# Altium schematic sheet DPT2.0.SchDoc
size A2; SheetNumber: 1; SheetTotal: 3
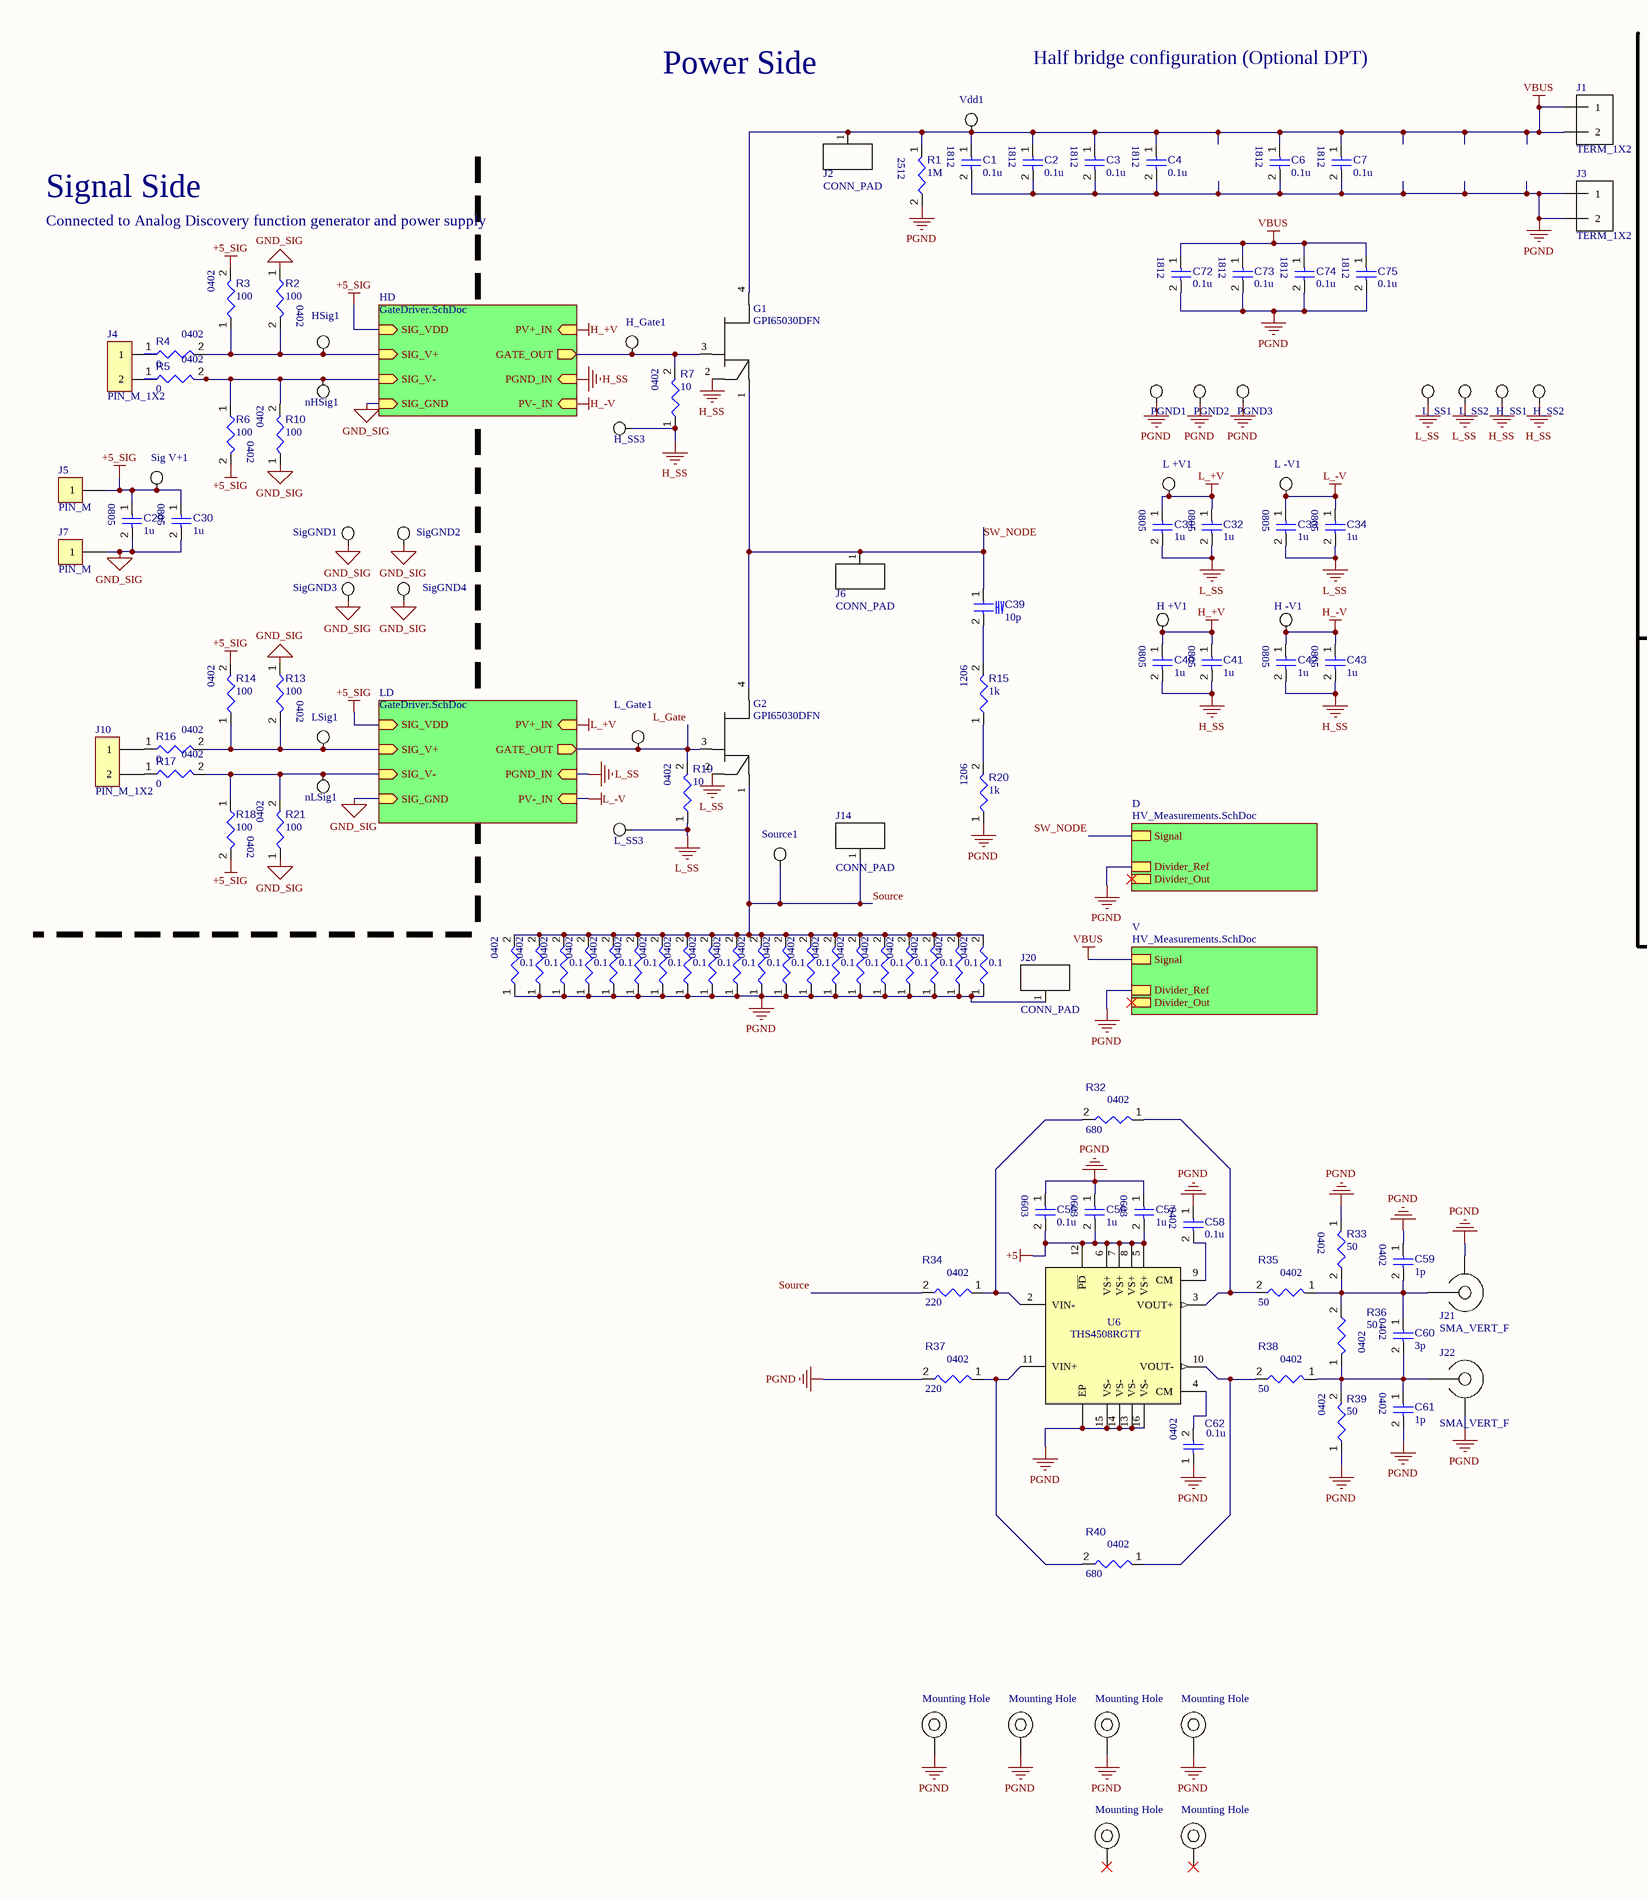
[diagram p0: DPT2.0.SchDoc, left]
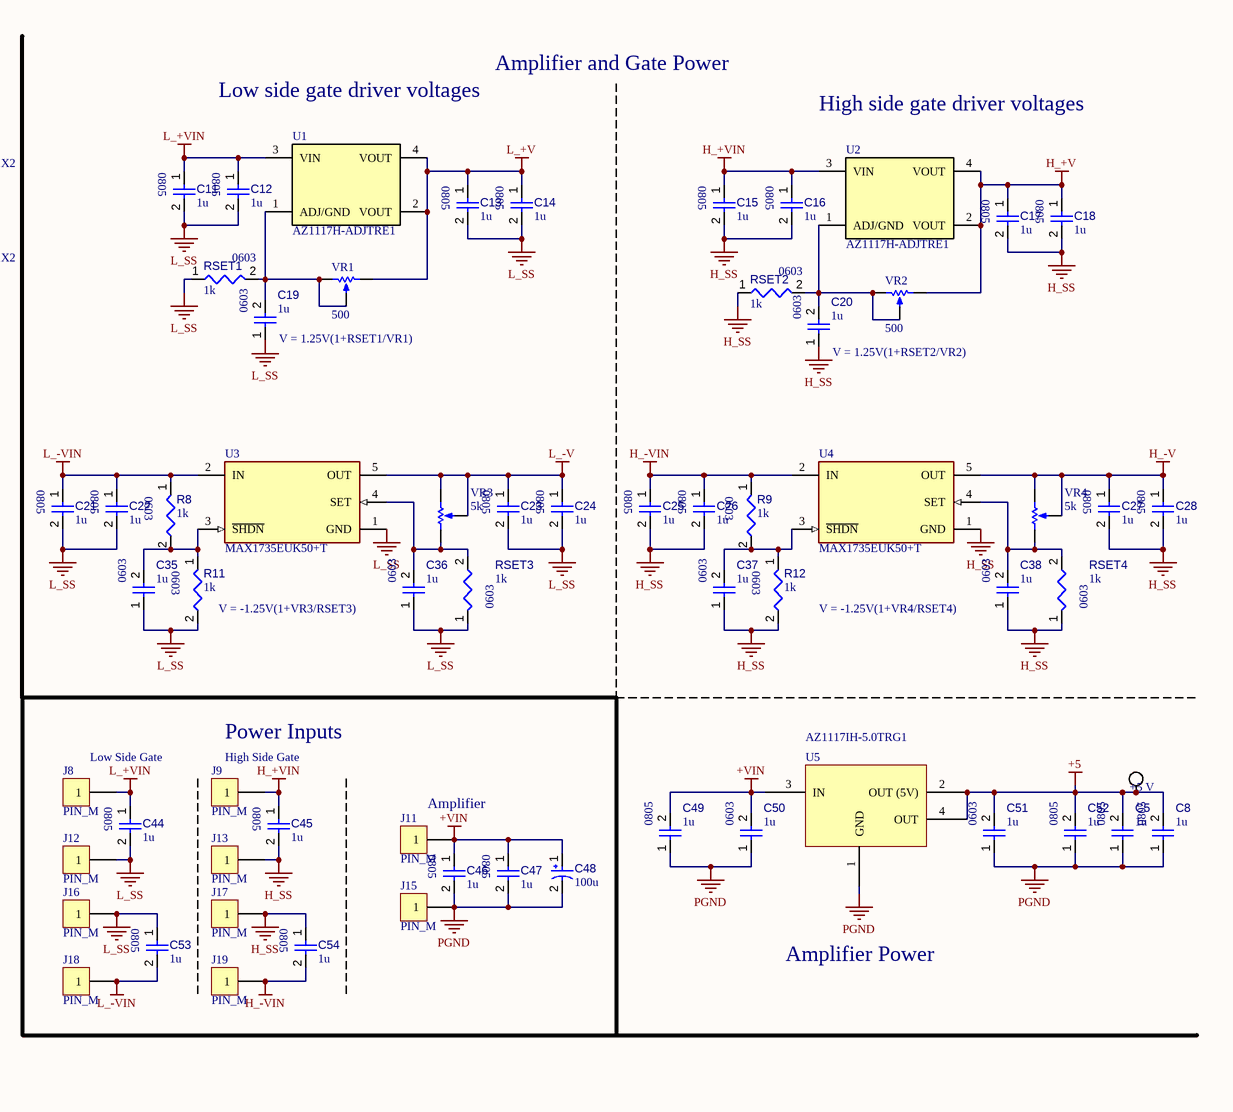
[diagram p1: DPT2.0.SchDoc, right]

## Parts
+5_V  Testpoint  [Testpoint-Footprint-1]  (value not drawn)
C1  value 0.1u  [CAP_1812]  (hidden comment: CAP-1812)
C2  value 0.1u  [CAP_1812]  (hidden comment: CAP-1812)
C3  value 0.1u  [CAP_1812]  (hidden comment: CAP-1812)
C4  value 0.1u  [CAP_1812]  (hidden comment: CAP-1812)
C5  value 1u  [CAP_0805_MED]  (hidden comment: CAP-0805)
C6  value 0.1u  [CAP_1812]  (hidden comment: CAP-1812)
C7  value 0.1u  [CAP_1812]  (hidden comment: CAP-1812)
C8  value 1u  [CAP_0805_MED]  (hidden comment: CAP-0805)
C11  value 1u  [CAP_0805_MED]  (hidden comment: CAP-0805)
C12  value 1u  [CAP_0805_MED]  (hidden comment: CAP-0805)
C13  value 1u  [CAP_0805_MED]  (hidden comment: CAP-0805)
C14  value 1u  [CAP_0805_MED]  (hidden comment: CAP-0805)
C15  value 1u  [CAP_0805_MED]  (hidden comment: CAP-0805)
C16  value 1u  [CAP_0805_MED]  (hidden comment: CAP-0805)
C17  value 1u  [CAP_0805_MED]  (hidden comment: CAP-0805)
C18  value 1u  [CAP_0805_MED]  (hidden comment: CAP-0805)
C19  value 1u  [CAP_0603_HIGH]  (hidden comment: CAP-0603)
C20  value 1u  [CAP_0603_HIGH]  (hidden comment: CAP-0603)
C21  value 1u  [CAP_0805_MED]  (hidden comment: CAP-0805)
C22  value 1u  [CAP_0805_MED]  (hidden comment: CAP-0805)
C23  value 1u  [CAP_0805_MED]  (hidden comment: CAP-0805)
C24  value 1u  [CAP_0805_MED]  (hidden comment: CAP-0805)
C25  value 1u  [CAP_0805_MED]  (hidden comment: CAP-0805)
C26  value 1u  [CAP_0805_MED]  (hidden comment: CAP-0805)
C27  value 1u  [CAP_0805_MED]  (hidden comment: CAP-0805)
C28  value 1u  [CAP_0805_MED]  (hidden comment: CAP-0805)
C29  value 1u  [CAP_0805_MED]  (hidden comment: CAP-0805)
C30  value 1u  [CAP_0805_MED]  (hidden comment: CAP-0805)
C31  value 1u  [CAP_0805_MED]  (hidden comment: CAP-0805)
C32  value 1u  [CAP_0805_MED]  (hidden comment: CAP-0805)
C33  value 1u  [CAP_0805_MED]  (hidden comment: CAP-0805)
C34  value 1u  [CAP_0805_MED]  (hidden comment: CAP-0805)
C35  value 1u  [CAP_0603_HIGH]  (hidden comment: CAP-0603)
C36  value 1u  [CAP_0603_HIGH]  (hidden comment: CAP-0603)
C37  value 1u  [CAP_0603_HIGH]  (hidden comment: CAP-0603)
C38  value 1u  [CAP_0603_HIGH]  (hidden comment: CAP-0603)
C39  value 10p  [CAP_1206_HV]  (hidden comment: CAP-1206-HV)
C40  value 1u  [CAP_0805_MED]  (hidden comment: CAP-0805)
C41  value 1u  [CAP_0805_MED]  (hidden comment: CAP-0805)
C42  value 1u  [CAP_0805_MED]  (hidden comment: CAP-0805)
C43  value 1u  [CAP_0805_MED]  (hidden comment: CAP-0805)
C44  value 1u  [CAP_0805_MED]  (hidden comment: CAP-0805)
C45  value 1u  [CAP_0805_MED]  (hidden comment: CAP-0805)
C46  value 1u  [CAP_0805_MED]  (hidden comment: CAP-0805)
C47  value 1u  [CAP_0805_MED]  (hidden comment: CAP-0805)
C48  value 100u  [PCAP_2MM_5MM]  (hidden comment: PCAP-2MMx5MM)
C49  value 1u  [CAP_0805_MED]  (hidden comment: CAP-0805)
C50  value 1u  [CAP_0603_HIGH]  (hidden comment: CAP-0603)
C51  value 1u  [CAP_0603_HIGH]  (hidden comment: CAP-0603)
C52  value 1u  [CAP_0805_MED]  (hidden comment: CAP-0805)
C53  value 1u  [CAP_0805_MED]  (hidden comment: CAP-0805)
C54  value 1u  [CAP_0805_MED]  (hidden comment: CAP-0805)
C55  value 0.1u  [CAP_0603_HIGH]  (hidden comment: CAP-0603)
C56  value 1u  [CAP_0603_HIGH]  (hidden comment: CAP-0603)
C57  value 1u  [CAP_0603_HIGH]  (hidden comment: CAP-0603)
C58  value 0.1u  [CAP_0402_HIGH]  (hidden comment: CAP-0402)
C59  value 1p  [CAP_0402_HIGH]  (hidden comment: CAP-0402)
C60  value 3p  [CAP_0402_HIGH]  (hidden comment: CAP-0402)
C61  value 1p  [CAP_0402_HIGH]  (hidden comment: CAP-0402)
C62  value 0.1u  [CAP_0402_HIGH]  (hidden comment: CAP-0402)
C72  value 0.1u  [CAP_1812]  (hidden comment: CAP-1812)
C73  value 0.1u  [CAP_1812]  (hidden comment: CAP-1812)
C74  value 0.1u  [CAP_1812]  (hidden comment: CAP-1812)
C75  value 0.1u  [CAP_1812]  (hidden comment: CAP-1812)
G1  GPI65030DFN  [DFN_8X8]
G2  GPI65030DFN  [DFN_8X8]
H_+V1  Testpoint  [Testpoint-Footprint-1]  (value not drawn)
H_-V1  Testpoint  [Testpoint-Footprint-1]  (value not drawn)
H_Gate1  Testpoint  [Testpoint-Footprint-1]  (value not drawn)
H_SS1  Testpoint  [Testpoint-Footprint-1]  (value not drawn)
H_SS2  Testpoint  [Testpoint-Footprint-1]  (value not drawn)
H_SS3  Testpoint  [Testpoint-Footprint-1]  (value not drawn)
HSig1  Testpoint  [Testpoint-Footprint-1]  (value not drawn)
J1  TERM_1X2  [J_TERM_BLK_1X2]
J2  CONN_PAD  [CONN_PAD]
J3  TERM_1X2  [J_TERM_BLK_1X2]
J4  PIN_M_1X2  [J_THT_2.54MM_1X2]
J5  PIN_M  [J_THT_1_PIN]
J6  CONN_PAD  [CONN_PAD]
J7  PIN_M  [J_THT_1_PIN]
J8  PIN_M  [J_THT_1_PIN]
J9  PIN_M  [J_THT_1_PIN]
J10  PIN_M_1X2  [J_THT_2.54MM_1X2]
J11  PIN_M  [J_THT_1_PIN]
J12  PIN_M  [J_THT_1_PIN]
J13  PIN_M  [J_THT_1_PIN]
J14  CONN_PAD  [CONN_PAD]
J15  PIN_M  [J_THT_1_PIN]
J16  PIN_M  [J_THT_1_PIN]
J17  PIN_M  [J_THT_1_PIN]
J18  PIN_M  [J_THT_1_PIN]
J19  PIN_M  [J_THT_1_PIN]
J20  CONN_PAD  [CONN_PAD]
J21  SMA_VERT_F  [SMA_VERT_F]
J22  SMA_VERT_F  [SMA_VERT_F]
L_+V1  Testpoint  [Testpoint-Footprint-1]  (value not drawn)
L_-V1  Testpoint  [Testpoint-Footprint-1]  (value not drawn)
L_Gate1  Testpoint  [Testpoint-Footprint-1]  (value not drawn)
L_SS1  Testpoint  [Testpoint-Footprint-1]  (value not drawn)
L_SS2  Testpoint  [Testpoint-Footprint-1]  (value not drawn)
L_SS3  Testpoint  [Testpoint-Footprint-1]  (value not drawn)
LSig1  Testpoint  [Testpoint-Footprint-1]  (value not drawn)
MH1  Mounting Hole  [Mounting Hole-Footprint-1]
MH2  Mounting Hole  [Mounting Hole-Footprint-1]
MH3  Mounting Hole  [Mounting Hole-Footprint-1]
MH4  Mounting Hole  [Mounting Hole-Footprint-1]
MH7  Mounting Hole  [Mounting Hole-Footprint-1]
MH8  Mounting Hole  [Mounting Hole-Footprint-1]
nHSig1  Testpoint  [Testpoint-Footprint-1]  (value not drawn)
nLSig1  Testpoint  [Testpoint-Footprint-1]  (value not drawn)
PGND1  Testpoint  [Testpoint-Footprint-1]  (value not drawn)
PGND2  Testpoint  [Testpoint-Footprint-1]  (value not drawn)
PGND3  Testpoint  [Testpoint-Footprint-1]  (value not drawn)
R1  value 1M  [RES_2512_MED]  (hidden comment: RES-2512)
R2  value 100  [RES_0402_HIGH]  (hidden comment: RES-0402)
R3  value 100  [RES_0402_HIGH]  (hidden comment: RES-0402)
R4  value 0  [RES_0402_HIGH]  (hidden comment: RES-0402)
R5  value 0  [RES_0402_HIGH]  (hidden comment: RES-0402)
R6  value 100  [RES_0402_HIGH]  (hidden comment: RES-0402)
R7  value 10  [RES_0402_HIGH]  (hidden comment: RES-0402)
R8  value 1k  [RES_0603_MED]  (hidden comment: RES-0603)
R9  value 1k  [RES_0603_MED]  (hidden comment: RES-0603)
R10  value 100  [RES_0402_HIGH]  (hidden comment: RES-0402)
R11  value 1k  [RES_0603_MED]  (hidden comment: RES-0603)
R12  value 1k  [RES_0603_MED]  (hidden comment: RES-0603)
R13  value 100  [RES_0402_HIGH]  (hidden comment: RES-0402)
R14  value 100  [RES_0402_HIGH]  (hidden comment: RES-0402)
R15  value 1k  [RES_1206_MED]  (hidden comment: RES-1206)
R16  value 0  [RES_0402_HIGH]  (hidden comment: RES-0402)
R17  value 0  [RES_0402_HIGH]  (hidden comment: RES-0402)
R18  value 100  [RES_0402_HIGH]  (hidden comment: RES-0402)
R19  value 10  [RES_0402_HIGH]  (hidden comment: RES-0402)
R20  value 1k  [RES_1206_MED]  (hidden comment: RES-1206)
R21  value 100  [RES_0402_HIGH]  (hidden comment: RES-0402)
R22  value 0.1  [RES_0402_HIGH]  (hidden comment: RES-0402)
R23  value 0.1  [RES_0402_HIGH]  (hidden comment: RES-0402)
R24  value 0.1  [RES_0402_HIGH]  (hidden comment: RES-0402)
R25  value 0.1  [RES_0402_HIGH]  (hidden comment: RES-0402)
R26  value 0.1  [RES_0402_HIGH]  (hidden comment: RES-0402)
R27  value 0.1  [RES_0402_HIGH]  (hidden comment: RES-0402)
R28  value 0.1  [RES_0402_HIGH]  (hidden comment: RES-0402)
R29  value 0.1  [RES_0402_HIGH]  (hidden comment: RES-0402)
R30  value 0.1  [RES_0402_HIGH]  (hidden comment: RES-0402)
R31  value 0.1  [RES_0402_HIGH]  (hidden comment: RES-0402)
R32  value 680  [RES_0402_HIGH]  (hidden comment: RES-0402)
R33  value 50  [RES_0402_HIGH]  (hidden comment: RES-0402)
R34  value 220  [RES_0402_HIGH]  (hidden comment: RES-0402)
R35  value 50  [RES_0402_HIGH]  (hidden comment: RES-0402)
R36  value 50  [RES_0402_HIGH]  (hidden comment: RES-0402)
R37  value 220  [RES_0402_HIGH]  (hidden comment: RES-0402)
R38  value 50  [RES_0402_HIGH]  (hidden comment: RES-0402)
R39  value 50  [RES_0402_HIGH]  (hidden comment: RES-0402)
R40  value 680  [RES_0402_HIGH]  (hidden comment: RES-0402)
R49  value 0.1  [RES_0402_HIGH]  (hidden comment: RES-0402)
R50  value 0.1  [RES_0402_HIGH]  (hidden comment: RES-0402)
R51  value 0.1  [RES_0402_HIGH]  (hidden comment: RES-0402)
R52  value 0.1  [RES_0402_HIGH]  (hidden comment: RES-0402)
R53  value 0.1  [RES_0402_HIGH]  (hidden comment: RES-0402)
R54  value 0.1  [RES_0402_HIGH]  (hidden comment: RES-0402)
R55  value 0.1  [RES_0402_HIGH]  (hidden comment: RES-0402)
R56  value 0.1  [RES_0402_HIGH]  (hidden comment: RES-0402)
R57  value 0.1  [RES_0402_HIGH]  (hidden comment: RES-0402)
R58  value 0.1  [RES_0402_HIGH]  (hidden comment: RES-0402)
RSET1  value 1k  [RES_0603_MED]  (hidden comment: RES-0603)
RSET2  value 1k  [RES_0603_MED]  (hidden comment: RES-0603)
RSET3  value 1k  [RES_0603_MED]  (hidden comment: RES-0603)
RSET4  value 1k  [RES_0603_MED]  (hidden comment: RES-0603)
Sig_V+1  Testpoint  [Testpoint-Footprint-1]  (value not drawn)
SigGND1  Testpoint  [Testpoint-Footprint-1]  (value not drawn)
SigGND2  Testpoint  [Testpoint-Footprint-1]  (value not drawn)
SigGND3  Testpoint  [Testpoint-Footprint-1]  (value not drawn)
SigGND4  Testpoint  [Testpoint-Footprint-1]  (value not drawn)
Source1  Testpoint  [Testpoint-Footprint-1]  (value not drawn)
U1  AZ1117H-ADJTRE1  [SOT-223]
U2  AZ1117H-ADJTRE1  [SOT-223]
U3  MAX1735EUK50+T  [FP-U5-2-IPC_B]
U4  MAX1735EUK50+T  [FP-U5-2-IPC_B]
U5  AZ1117IH-5.0TRG1  [SOT230P700X180-4N]
U6  THS4508RGTT  [QFN-16]
Vdd1  Testpoint  [Testpoint-Footprint-1]  (value not drawn)
VR1  value 500  [TRIM_J-LEAD]  (hidden comment: RES_POT_JLEAD)
VR2  value 500  [TRIM_J-LEAD]  (hidden comment: RES_POT_JLEAD)
VR3  value 5k  [TRIM_J-LEAD]  (hidden comment: RES_POT_JLEAD)
VR4  value 5k  [TRIM_J-LEAD]  (hidden comment: RES_POT_JLEAD)

## Sub-sheets
D = HV_Measurements.SchDoc: Divider_Ref, Divider_Out, Signal
HD = GateDriver.SchDoc: GATE_OUT (out), SIG_V+ (in), SIG_V- (in), SIG_GND (in), SIG_VDD (in), PGND_IN (in), PV+_IN (in), PV-_IN (in)
LD = GateDriver.SchDoc: GATE_OUT (out), SIG_V+ (in), SIG_V- (in), SIG_GND (in), SIG_VDD (in), PGND_IN (in), PV+_IN (in), PV-_IN (in)
V = HV_Measurements.SchDoc: Divider_Ref, Divider_Out, Signal

## Nets
+5: +5_V.1 C5.2 C8.2 C51.2 C52.2 C55.2 C56.2 C57.2 U5.2(OUT_(5V)) U5.4(OUT) U6.5(VS+) U6.6(VS+) U6.7(VS+) U6.8(VS+) U6.12(~{PD})
+5_SIG: C29.1 C30.1 J5.1 R3.2 R6.2 R14.2 R18.2 Sig_V+1.1 ; sheet HD/SIG_VDD, sheet LD/SIG_VDD
+VIN: C46.1 C47.1 C48.1 C49.2 C50.2 J11.1 U5.3(IN)
GND_SIG: C29.2 C30.2 J7.1 R2.1 R10.1 R13.1 R21.1 SigGND1.1 SigGND2.1 SigGND3.1 SigGND4.1 ; sheet HD/SIG_GND, sheet LD/SIG_GND
H_+V: C17.1 C18.1 C40.1 C41.1 H_+V1.1 U2.2(VOUT) U2.4(VOUT) VR2.1(CCW) ; sheet HD/PV+_IN
H_+VIN: C15.1 C16.1 C45.1 J9.1 U2.3(VIN)
H_-V: C27.1 C28.1 C42.1 C43.1 H_-V1.1 U4.5(OUT) VR4.2(S) VR4.3(CW) ; sheet HD/PV-_IN
H_-VIN: C25.1 C26.1 C54.2 J19.1 R9.1 U4.2(IN)
H_SS: C15.2 C16.2 C17.2 C18.2 C20.1 C25.2 C26.2 C27.2 C28.2 C37.1 C38.1 C40.2 C41.2 C42.2 C43.2 C45.2 C54.1 G1.2(KS) H_SS1.1 H_SS2.1 H_SS3.1 J13.1 J17.1 R7.1 R12.2 RSET2.1 RSET4.1 U4.1(GND) ; sheet HD/PGND_IN
L_+V: C13.1 C14.1 C31.1 C32.1 L_+V1.1 U1.2(VOUT) U1.4(VOUT) VR1.1(CCW) ; sheet LD/PV+_IN
L_+VIN: C11.1 C12.1 C44.1 J8.1 U1.3(VIN)
L_-V: C23.1 C24.1 C33.1 C34.1 L_-V1.1 U3.5(OUT) VR3.2(S) VR3.3(CW) ; sheet LD/PV-_IN
L_-VIN: C21.1 C22.1 C53.2 J18.1 R8.1 U3.2(IN)
L_SS: C11.2 C12.2 C13.2 C14.2 C19.1 C21.2 C22.2 C23.2 C24.2 C31.2 C32.2 C33.2 C34.2 C35.1 C36.1 C44.2 C53.1 G2.2(KS) J12.1 J16.1 L_SS1.1 L_SS2.1 L_SS3.1 R11.2 R19.1 RSET1.1 RSET3.1 U3.1(GND) ; sheet LD/PGND_IN
PGND: C1.2 C2.2 C3.2 C4.2 C5.1 C6.2 C7.2 C8.1 C46.2 C47.2 C48.2 C49.1 C50.1 C51.1 C52.1 C55.1 C56.1 C57.1 C58.1 C59.1 C61.2 C62.1 C72.2 C73.2 C74.2 C75.2 J3.1 J3.2 J15.1 J20.1 J21.2 J22.2 MH1.1(GND) MH2.1(GND) MH3.1(GND) MH4.1(GND) PGND1.1 PGND2.1 PGND3.1 R1.2 R20.1 R22.1 R23.1 R24.1 R25.1 R26.1 R27.1 R28.1 R29.1 R30.1 R31.1 R33.1 R37.2 R39.1 R49.1 R50.1 R51.1 R52.1 R53.1 R54.1 R55.1 R56.1 R57.1 R58.1 U5.1(GND) U6.13(VS-) U6.14(VS-) U6.15(VS-) U6.16(VS-) U6.17(EP) ; sheet V/Divider_Ref, sheet D/Divider_Ref
VBUS: C1.1 C2.1 C3.1 C4.1 C6.1 C7.1 C72.1 C73.1 C74.1 C75.1 G1.4(D) J1.1 J1.2 J2.1 R1.1 Vdd1.1 ; sheet V/Signal
L_Gate: G2.3(G) L_Gate1.1 R19.2 ; sheet LD/GATE_OUT
Source: G2.1(S) J14.1 R22.2 R23.2 R24.2 R25.2 R26.2 R27.2 R28.2 R29.2 R30.2 R31.2 R34.2 R49.2 R50.2 R51.2 R52.2 R53.2 R54.2 R55.2 R56.2 R57.2 R58.2 Source1.1
SW_NODE: C39.1 G1.1(S) G2.4(D) J6.1 ; sheet D/Signal
NetC19_2: C19.2 RSET1.2 U1.1(ADJ/GND) VR1.2(S) VR1.3(CW)
NetC20_2: C20.2 RSET2.2 U2.1(ADJ/GND) VR2.2(S) VR2.3(CW)
NetC35_2: C35.2 R8.2 R11.1 U3.3(~{SHDN})
NetC36_2: C36.2 RSET3.2 U3.4(SET) VR3.1(CCW)
NetC37_2: C37.2 R9.2 R12.1 U4.3(~{SHDN})
NetC38_2: C38.2 RSET4.2 U4.4(SET) VR4.1(CCW)
NetC39_2: C39.2 R15.2
NetC58_2: C58.2 U6.9(CM)
NetC59_2: C59.2 C60.1 J21.1 R33.2 R35.1 R36.2
NetC60_2: C60.2 C61.1 J22.1 R36.1 R38.1 R39.2
NetC62_2: C62.2 U6.4(CM)
NetG1_3: G1.3(G) H_Gate1.1 R7.2 ; sheet HD/GATE_OUT
NetHSig1_1: HSig1.1 R2.2 R3.1 R4.2 ; sheet HD/SIG_V+
NetJ4_1: J4.1 R4.1
NetJ4_2: J4.2 R5.1
NetJ10_1: J10.1 R16.1
NetJ10_2: J10.2 R17.1
NetLSig1_1: LSig1.1 R13.2 R14.1 R16.2 ; sheet LD/SIG_V+
NetnHSig1_1: nHSig1.1 R5.2 R6.1 R10.2 ; sheet HD/SIG_V-
NetnLSig1_1: nLSig1.1 R17.2 R18.1 R21.2 ; sheet LD/SIG_V-
NetR15_1: R15.1 R20.2
NetR32_1: R32.1 R35.2 U6.3(VOUT+)
NetR32_2: R32.2 R34.1 U6.2(VIN-)
NetR37_1: R37.1 R40.2 U6.11(VIN+)
NetR38_2: R38.2 R40.1 U6.10(VOUT-)

Not connected (* = marked no-connect by the designer): MH7 1(GND)*; MH8 1(GND)*

## Notes on the sheet
- Power Side
- Half bridge configuration (Optional DPT)
- Low side gate driver voltages
- Amplifier and Gate Power
- High side gate driver voltages
- Signal Side
- Connected to Analog Discovery function generator and power supply
- (near C19) V = 1.25V(1+RSET1/VR1)
- (near C20) V = 1.25V(1+RSET2/VR2)
- (near R11) V = -1.25V(1+VR3/RSET3)
- V = -1.25V(1+VR4/RSET4)
- (near J8) Low Side Gate
- (near J9) High Side Gate
- Power Inputs
- (near J11) Amplifier
- Amplifier Power

## Library data of the parts
+5_V H_+V1 H_-V1 H_Gate1 H_SS1-H_SS3 HSig1 L_+V1 L_-V1 L_Gate1 L_SS1-L_SS3 LSig1 nHSig1 nLSig1 PGND1-PGND3 Sig_V+1 SigGND1-SigGND4 Source1 Vdd1 = CMP-001-0000-5: testpoint for circuit
C1-C4 C6 C7 C72-C75 = CMP-001-00088-2: Non polarized SMD capacitor - 1812 (4532 Metric); Package: 1812
C5 C8 C11-C18 C21-C34 C40-C47 C49 C52-C54 = CMP-001-00086-3: Non polarized SMD capacitor - 0805 (1608 Metric); Package: 0805
C19 C20 C35-C38 C50 C51 C55-C57 = CMP-001-00084-2: Non polarized SMD capacitor - 0603 (1608 Metric); Package: 0603
C39 = CMP-001-00089-1: Non polarized SMD capacitor - 1206 (3216 Metric) High Voltage; Voltage Rating: 1kV; Package: 1206
C48 = CMP-001-00091-1: Polarized THT capacitor - Radial can, 2mm lead spacing, 5mm diameter
C58-C62 = CMP-001-00083-3: Non polarized SMD capacitor - 0402 (1005 Metric); Package: 0402
G1 G2 = CMP-023-000000-5: 650V 15A GaN Enhancement mode Transistor; pin to pad: 1>1+2+9 2>3 3>4 4>5+6+7+8; Package: DFN8X8
J1 J3 = CMP-002-00071-1: Terminal Block 1X2, 6.35mm pitch
J2 J6 J14 J20 = CMP-002-00074-4: Solderable Connection Pad
J4 J10 = CMP-002-00073-2: Male Pin 2.54mm pitch 1X2
J5 J7-J9 J11-J13 J15-J19 = CMP-002-00072-1: Male Pin, 1 Pin
J21 J22 = CMP-025-000000-6: SMA connector, Vertical, Female; pin to pad: 2>2+3+4+5; Package: SMA
MH1-MH4 MH7 MH8 = CMP-032-000006-1
R1 = CMP-009-00182-3: SMD Resistor - 2512 (6432 Metric); Package: 2512
R2-R7 R10 R13 R14 R16-R19 R21-R40 R49-R58 = CMP-009-00177-2: SMD Resistor - 0402 (1005 Metric); Package: 0402
R8 R9 R11 R12 RSET1-RSET4 = CMP-009-00178-2: SMD Resistor - 0603 (1608 Metric); Package: 0603
R15 R20 = CMP-009-00180-2: SMD Resistor - 1206 (3216 Metric); Package: 1206
U1 U2 = CMP-019-00050-1: IC REG LINEAR POS ADJ 1A SOT223; Package: SOT223
U3 U4 = CMP-05721-000044-1: IC REG LIN NEG ADJ 200MA SOT23-5
U5 = CMP-032-000005-2: https://www.digikey.ca/en/products/detail/diodes-incorporated/AZ1117IH-5-0TRG1/5699673
U6 = CMP-027-000000-12: WIDEBAND, LOW NOISE, LOW DISTORTION FULLY DIFFERENTIAL AMPLIFIER; pin to pad: 17>17+18+19+20+21; Package: QFN3X3
VR1-VR4 = CMP-009-00181-2: Potentiometer, J-Lead Trim Pot; pin to pad: 2>3 3>2